# Altium schematic sheet 5V and 3V3 Outputs.SchDoc
size A4
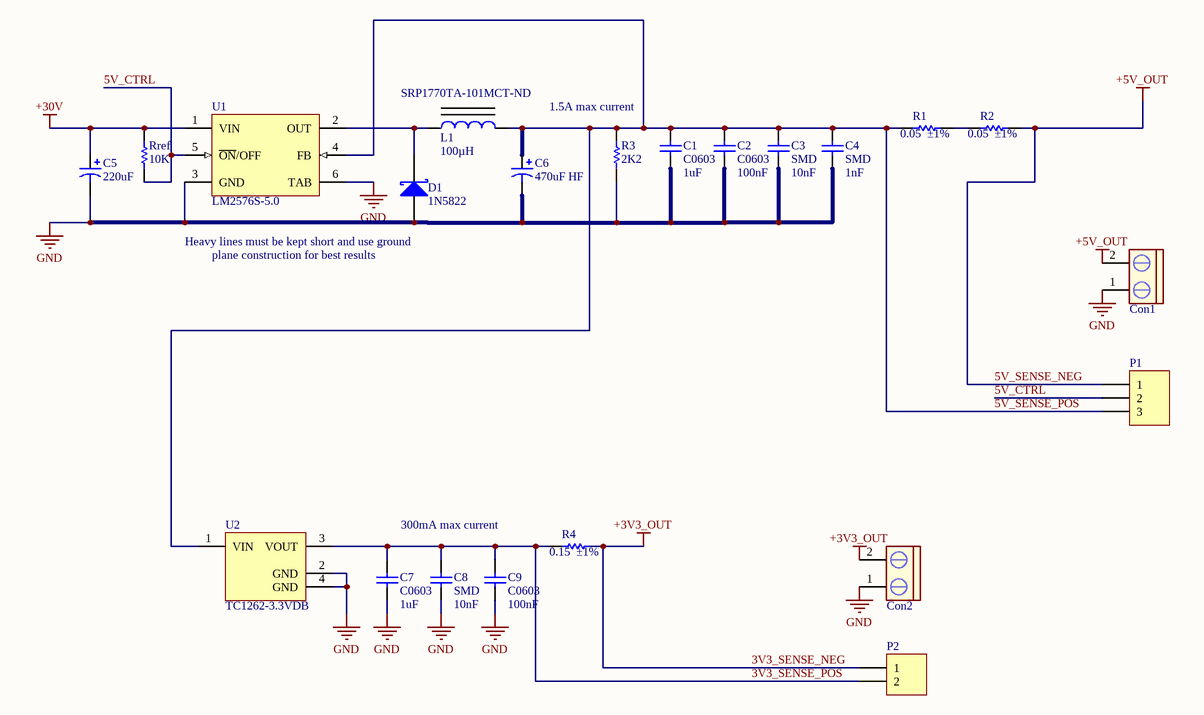
[diagram p0: 5V and 3V3 Outputs.SchDoc]

## Parts
C1  C0603  value 1uF  [0603]
C2  C0603  value 100nF  [0603]
C3  SMD  value 10nF  [1206]
C4  SMD  value 1nF  [1206]
C5  220uF  [CAPPR5-10X16]
C6  470uF HF  [CAPPR5-10X20]
C7  C0603  value 1uF  [0603]
C8  SMD  value 10nF  [1206]
C9  C0603  value 100nF  [0603]
Con1  Salida Buck  [My_CN2]  (value not drawn)
Con2  Salida Buck  [My_CN2]  (value not drawn)
D1  1N5822  [Vertical DO-201AD 10.5mm]
L1  Supplier Part Number: SRP1770TA-101MCT-ND  Inductance: 100µH  [SRP1770TA Series]  (hidden comment: Ferrite Inductor)
P1  Header 3  [My_1X03]  (value not drawn)
P2  Header 2  [My_1X02]  (value not drawn)
R1  Resistance (Ohms): 0.05  Tolerance: ±1%  [L1W-2512]  (hidden comment: ERJL1W)
R2  Resistance (Ohms): 0.05  Tolerance: ±1%  [L1W-2512]  (hidden comment: ERJL1W)
R3  2K2  [ERA-0603]
R4  Resistance (Ohms): 0.15  Tolerance: ±1%  [8RB-1206]  (hidden comment: SMD)
Rref  10K  [ERA-0603]
U1  LM2576S-5.0  [TS5B_N]
U2  TC1262-3.3VDB  [SOT-223-DB3_N]

## Nets
3V3_SENSE_NEG: Con2.2 P2.1 R4.2  [also labelled +3V3_OUT]
5V_SENSE_NEG: Con1.2 P1.1 R2.2  [also labelled +5V_OUT]
+30V: C5.1 Rref.2 U1.1(VIN)
GND: C1.1 C2.1 C3.1 C4.1 C5.2 C6.2 C7.1 C8.1 C9.1 Con1.1 Con2.1 D1.1(A) R3.1 U1.3(GND) U1.6(TAB) U2.2(GND) U2.4(GND)
3V3_SENSE_POS: C7.2 C8.2 C9.2 P2.2 R4.1 U2.3(VOUT)
5V_CTRL: P1.2 Rref.1 U1.5(~{ON}/OFF)
5V_SENSE_POS: C1.2 C2.2 C3.2 C4.2 C6.1 L1.2 P1.3 R1.1 R3.2 U1.4(FB) U2.1(VIN)
NetD1_2: D1.2(K) L1.1 U1.2(OUT)
NetR1_2: R1.2 R2.1

## Notes on the sheet
- 1.5A max current
- Heavy lines must be kept short and use ground
- plane construction for best results
- 300mA max current

## Library data of the parts
C1 C2 C7 C9 = C0603: C1608X7R1C105K X7R; Note: Footprint corresponds to dimensions for bulk cassette packaging. This case size has tightened tolerances.; Published: 17-Jul-2002; LatestRevisionDate: 19-Mar-2004; LatestRevisionNote: Silkscreen size reduced.; DatasheetDocument: Mar-2001; PackageDocument: Mar-2001; PackageReference: 0603; Publisher: Altium Limited; Code_JEITA: 0603; Code_IPC: 1608 [0603]; ComponentLink1Description: Manufacturer Link; ComponentLink1URL: http://www.kemet.com/; ComponentLink2Description: Datasheet; ComponentLink2URL: http://www.kemet.com/kemet/web/homepage/kechome.nsf/vapubfilesname/F3102TA.pdf/$file/F3102TA.pdf
C3 C4 C8 = C1206: Ceramic Chip Capacitor - Standard; Published: 17-Jul-2002; LatestRevisionDate: 19-Mar-2004; LatestRevisionNote: Silkscreen size reduced.; DatasheetDocument: Mar-2001; PackageDocument: Mar-2001; PackageReference: 1206; Publisher: Altium Limited; Code_JEITA: 1206; Code_IPC: 3216 [1206]; ComponentLink1Description: Manufacturer Link; ComponentLink1URL: http://www.kemet.com/; ComponentLink2Description: Datasheet; ComponentLink2URL: http://www.kemet.com/kemet/web/homepage/kechome.nsf/vapubfilesname/F3102TA.pdf/$file/F3102TA.pdf
C5 = EKA00DD322J00: Aluminum Electrolytic Capacitor, Radial Style with Long Leads: 220uF, 63V; Note: Refer to Manufacturer's Data Sheets for other lead formations; DrillSize: Nominal, Rounded To The Nearest 0.1mm; Published: 19-Mar-2004; DatasheetDocument: 20-Feb-2001; PackageReference: CAPPR5-10X16; Publisher: Altium Limited; ComponentLink1Description: Manufacturer Link; ComponentLink1URL: http://www.vishay.com/; ComponentLink2Description: Datasheet; ComponentLink2URL: http://www.vishay.com/docs/25014/eka.pdf; Value: 220uF
C6 = EKC00DE347E00: Aluminum Electrolytic Capacitor, Radial Style with Long Leads: 470uF, 25V; Note: Refer to Manufacturer's Data Sheets for other lead formations; DrillSize: Nominal, Rounded To The Nearest 0.1mm; Published: 19-Mar-2004; DatasheetDocument: 12-Jan-2000; PackageReference: CAPPR5-10X20; Publisher: Altium Limited; ComponentLink1Description: Manufacturer Link; ComponentLink1URL: http://www.vishay.com/; ComponentLink2Description: Datasheet; ComponentLink2URL: http://www.vishay.com/docs/25009/ekc.pdf; Value: 470uF
Con1 Con2 = CON2 pin blue: Connector blue screw
D1 = Generic Schottky Diode
L1 = Ferrite Inductor: Manufacturer Part Number: SRP1770TA-101M; Manufacturer: Bourns Inc.; Value: 100uH; Tolerance: ±20%; Type: Wirewound; DC Resistance (DCR): 118 mOhm Max; Current Rating: 5.3A; Current - Saturation: 6.5A; Shielding: Shielded; Material - Core: Carbonyl Powder; Frequency - Self Resonant: 2MHz; Q @ Freq: 20 @ 100kHz; Supplier Device Package: -; Package / Case: Nonstandard; Operating Temperature: -40°C ~ 150°C; Mounting Type: Surface Mount; Height - Seated (Max): 0.276" (7.00mm); Size / Dimension: 0.666" L x 0.666" W (16.90mm x 16.90mm); Part Status: Active; Ratings: AEC-Q200; Category: Inductors, Coils, Chokes; Packaging: Cut Tape (CT); RoHS: RoHS Compliant; Supplier: Digi-Key
P1 = Header 3: Header, 3-Pin; LatestRevisionDate: 17-Jul-2002; LatestRevisionNote: Re-released for DXP Platform.; Publisher: Altium Limited
P2 = Header 2: Header, 2-Pin; LatestRevisionDate: 17-Jul-2002; LatestRevisionNote: Re-released for DXP Platform.; Publisher: Altium Limited
R1 R2 = ERJL1W: Low Ohmic Value Thick Film Chip Resistor, 40m Ohm to 100m Ohm Range, 1% and 5% Tolerance, 2512 Size, 1 W; Manufacturer Part Number: PE2512FKE070R05L; Manufacturer: Yageo; Power (Watts): 1W; Temperature Coefficient: ±50ppm/°C; Published: 17-Dec-2003; LatestRevisionDate: 19-Mar-2004; LatestRevisionNote: Silkscreen size reduced.; PackageDocument: Mar-2003; PackageReference: L1W-2512; Publisher: Altium Limited; ComponentLink1Description: Manufacturer Link; ComponentLink1URL: http://www.panasonic.com/industrial/components/resistive_products.htm; ComponentLink2Description: Datasheet; ComponentLink2URL: http://www.panasonic.com/industrial/components/pdf/AOA0000CE3.pdf; Features: Automotive AEC-Q200, Current Sense, Moisture Resistant; Supplier: Digi-Key; Package / Case: 2512 (6432 Metric); RoHS: RoHS Compliant; Height - Seated (Max): 0.035" (0.89mm); Size / Dimension: 0.250" L x 0.125" W (6.35mm x 3.18mm); Supplier Device Package: 2512; Part Status: Active; Packaging: Cut Tape (CT); Operating Temperature: -55°C ~ 170°C; Composition: Metal Film; Category: Resistors; Failure Rate: -; Supplier Part Number: YAG2156CT-ND
R3 Rref = ERA3Y: Rectangular Thick Film Chip Resistor, 10 Ohm to 330k Ohm Range, 0.1% and 0.5% Tolerance, 0603 Size, 0.063 W; Note: If flow soldering, adjust pad width of PCB Footprint to 0.7 - 0.8 times the width of the resistor.; Published: 17-Dec-2003; LatestRevisionDate: 19-Mar-2004; LatestRevisionNote: Silkscreen size reduced.; PackageDocument: Mar-2003; PackageReference: ERA-0603; Publisher: Altium Limited; Code_IPC: 1608 [0603]; ComponentLink1Description: Manufacturer Link; ComponentLink1URL: http://www.panasonic.com/industrial/components/resistive_products.htm; ComponentLink2Description: Datasheet; ComponentLink2URL: http://www.panasonic.com/industrial/components/pdf/AOA0000CE8.pdf
R4 = ERJ8BQ: Low Ohmic Value Thick Film Chip Resistor, 0.22 Ohm to 9.1 Ohm Range, 1%, 2% and 5% Tolerance, 1206 Size, 0.33 W; Manufacturer Part Number: KRL1632E-M-R150-F-T5; Manufacturer: Susumu; Power (Watts): 0.75W, 3/4W; Temperature Coefficient: ±50ppm/°C; Features: Automotive AEC-Q200, Current Sense; Failure Rate: -; RoHS: RoHS Compliant; Supplier Device Package: 1206; Category: Resistors; Packaging: Tape & Reel (TR); Height - Seated (Max): 0.028" (0.70mm); Supplier Part Number: 408-1584-2-ND; Operating Temperature: -55°C ~ 155°C; Composition: Metal Foil; Supplier: Digi-Key; Part Status: Active; Size / Dimension: 0.126" L x 0.063" W (3.20mm x 1.60mm); Package / Case: 1206 (3216 Metric)
U1 = LM2576S-5.0: SIMPLE SWITCHER® 3A Step-Down Voltage Regulator, 5-pin TO-263; Manufacturer: National Semiconductor; PackageTopMarking: NSUZXYTTE#*LM2576S*-5.0 P+; PowerWise: N; High-Reliability: Y; DatasheetVersion: Aug-2004; PackageVersion: revD, Apr-2005; PackageReference: TS5B; PackageDescription: TO-263, Molded, .400 x .390 x .180in, 5 Lead, .067in Pitch, Surface Mount; PartNumber: LM2576S-5.0; RoHS: N; PinCount: 5; CompType: Switcher; Code_JEDEC: MO-169-AB; ComponentLink1Description: Manufacturer URL; ComponentLink1URL: http://www.national.com/; ComponentLink2Description: LM2576 Datasheet; ComponentLink2URL: http://www.national.com/ds/LM/LM2576.pdf; ComponentLink3Description: LM2576 Web Page; ComponentLink3URL: http://www.national.com/pf/LM/LM2576.html; ComponentLink4Description: TS5B Package Page; ComponentLink4URL: http://www.national.com/packaging/folders/ts5b.html
U2 = TC1262-3.3VDB: 500mA Fixed Output CMOS LDO, 3-Pin SOT-223, Extended Temperature; Manufacturer: Microchip; DatasheetVersion: revB, 2002; PackageVersion: revBB, Aug-2009; PackageReference: SOT-223-DB3; PackageDescription: 3-Lead Plastic Small Outline Transistor (DB) [SOT-223]; Supplier 1: Digi-Key; Supplier Part Number 1: TC1262-3.3VDB-ND; Supplier 2: Farnell; Supplier Part Number 2: 1852183; Supplier 3: Newark; Supplier Part Number 3: 53R0370; Supplier 4: Mouser; Supplier Part Number 4: 579-TC1262-3.3VDB; Mounting Technology: Surface Mount; PartNumber: TC1262-3.3VDB; ComponentLink1Description: Manufacturer URL; ComponentLink1URL: http://www.microchip.com/; ComponentLink2Description: Datasheet; ComponentLink2URL: http://ww1.microchip.com/downloads/en/DeviceDoc/21373b.pdf; ComponentLink3Description: Package Specification; ComponentLink3URL: http://www.microchip.com/stellent/groups/techpub_sg/documents/packagingspec/en012702.pdf